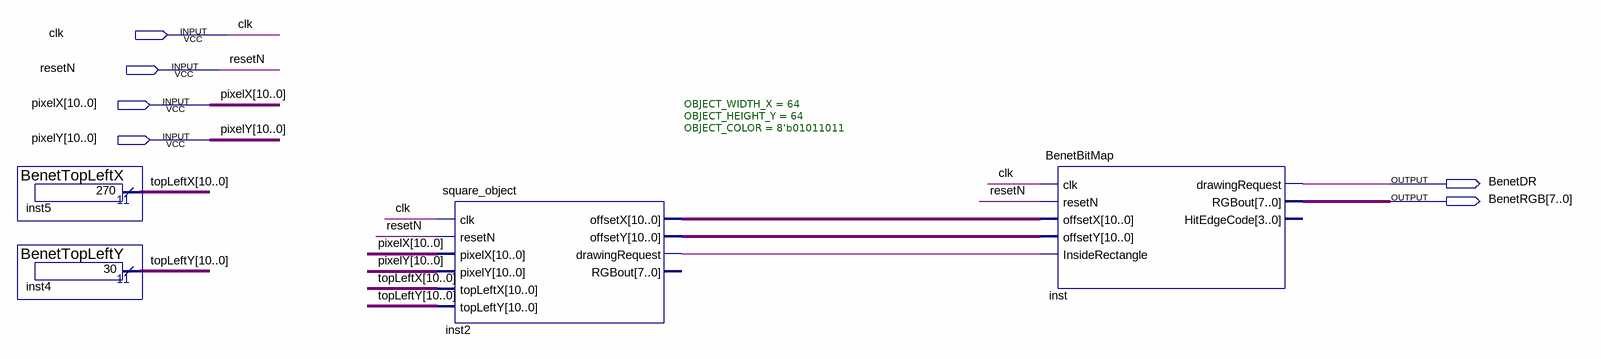
[diagram p0: schematic sheet]
// Quartus schematic Benet_Block.bdf as structural Verilog: 4 symbols, 6 pins
module Benet_Block (
  input  clk,
  input  resetN,
  input  [10:0] pixelX,
  input  [10:0] pixelY,
  output BenetDR,
  output [7:0] BenetRGB
);

  wire inst2_drawingrequest;
  wire [10:0] inst2_offsetx, inst2_offsety, topLeftX, topLeftY;

  BenetTopLeftX inst5 (.result(topLeftX));
  BenetTopLeftY inst4 (.result(topLeftY));
  square_object #(.OBJECT_WIDTH_X(64), .OBJECT_HEIGHT_Y(64), .OBJECT_COLOR(8'b01011011)) inst2 (
    .clk(clk), .resetN(resetN), .pixelX(pixelX), .pixelY(pixelY), .topLeftX(topLeftX), .topLeftY(topLeftY),
    .offsetX(inst2_offsetx), .offsetY(inst2_offsety), .drawingRequest(inst2_drawingrequest));  // open: RGBout
  BenetBitMap inst (
    .clk(clk), .resetN(resetN), .offsetX(inst2_offsetx), .offsetY(inst2_offsety),
    .InsideRectangle(inst2_drawingrequest), .drawingRequest(BenetDR), .RGBout(BenetRGB));  // open: HitEdgeCode
endmodule
